# Altium schematic sheet 03_ANALOG.SchDoc: WMI (AFE)
size A4
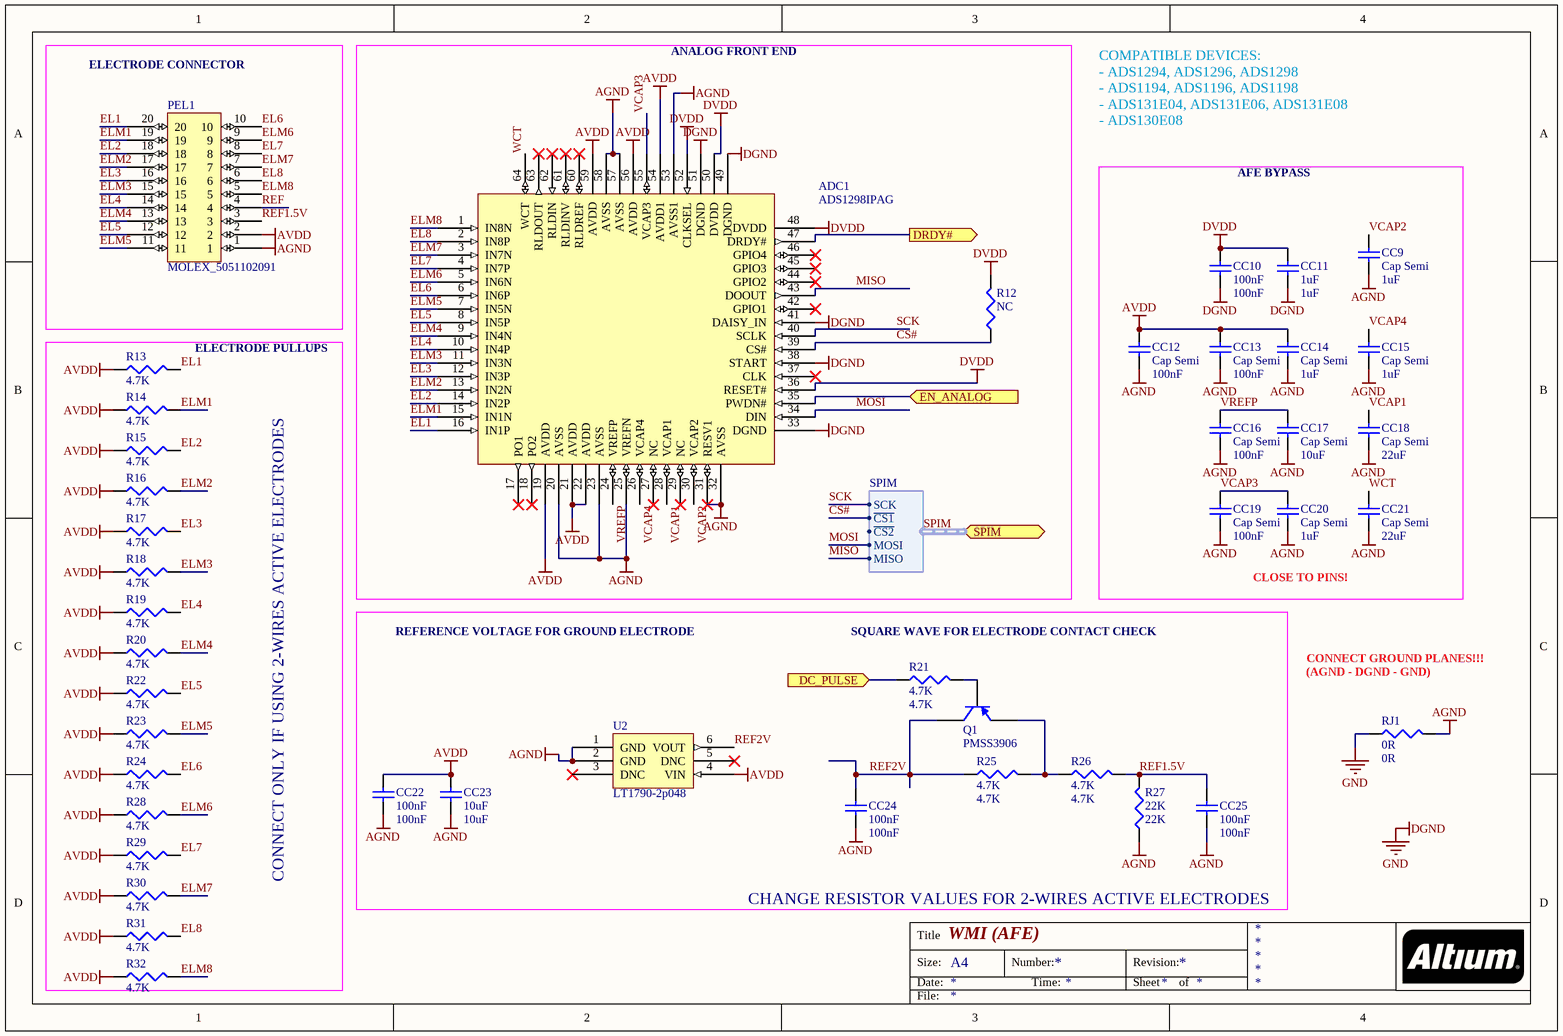
[diagram p0: 03_ANALOG.SchDoc]

## Parts
ADC1  ADS1298IPAG  [LQFP64_M]
CC9  Cap Semi  value 1uF  [0402]
CC10  100nF  [0402]
CC11  1uF  [0402]
CC12  Cap Semi  value 100nF  [0402]
CC13  Cap Semi  value 100nF  [0402]
CC14  Cap Semi  value 1uF  [0402]
CC15  Cap Semi  value 1uF  [0402]
CC16  Cap Semi  value 100nF  [0402]
CC17  Cap Semi  value 10uF  [0402]
CC18  Cap Semi  value 22uF  [J1-0603]
CC19  Cap Semi  value 100nF  [0402]
CC20  Cap Semi  value 1uF  [0402]
CC21  Cap Semi  value 22uF  [1608[0603]]
CC22  100nF  [0402]
CC23  10uF  [0402]
CC24  100nF  [0402]
CC25  100nF  [0402]
PEL1  MOLEX_5051102091  [MOLEX_5051102091]
Q1  PMSS3906  [SOT323_N]
R12  NC  [0402]
R13  4.7K  [0402]
R14  4.7K  [0402]
R15  4.7K  [0402]
R16  4.7K  [0402]
R17  4.7K  [0402]
R18  4.7K  [0402]
R19  4.7K  [0402]
R20  4.7K  [0402]
R21  4.7K  [0402]
R22  4.7K  [0402]
R23  4.7K  [0402]
R24  4.7K  [0402]
R25  4.7K  [0402]
R26  4.7K  [0402]
R27  22K  [0402]
R28  4.7K  [0402]
R29  4.7K  [0402]
R30  4.7K  [0402]
R31  4.7K  [0402]
R32  4.7K  [0402]
RJ1  0R  [0402]
U2  LT1790-2p048  [SOT-23_A_N]

## Blocks framed on the sheet
ELECTRODE CONNECTOR: PEL1
ANALOG FRONT END: ADC1 R12
CONNECT ONLY IF USING 2-WIRES ACTIVE ELECTRODES: R13-R20 R22-R24 R28-R32
CHANGE RESISTOR VALUES FOR 2-WIRES ACTIVE ELECTRODES: CC22-CC25 Q1 R21 R25-R27 U2

## Ports
DC_PULSE (in), DRDY# (out), EN_ANALOG (in), SPIM (harness SPIM)

## Harnesses
SPIM: SCK, ~{CS1}, ~{CS2}, MOSI, MISO

## Nets
AGND: ADC1.20(AVSS) ADC1.23(AVSS) ADC1.25(VREFN) ADC1.31(RESV1) ADC1.32(AVSS) ADC1.53(AVSS1) ADC1.57(AVSS) ADC1.58(AVSS) CC9.1 CC12.1 CC13.1 CC14.1 CC15.1 CC16.1 CC17.1 CC18.1 CC19.1 CC20.1 CC21.1 CC22.1 CC23.1 CC24.1 CC25.1 PEL1.1 R27.1 RJ1.2 U2.1(GND) U2.2(GND)
AVDD: ADC1.19(AVDD) ADC1.21(AVDD) ADC1.22(AVDD) ADC1.54(AVDD1) ADC1.56(AVDD) ADC1.59(AVDD) CC12.2 CC13.2 CC14.2 CC22.2 CC23.2 PEL1.2 R13.1 R14.1 R15.1 R16.1 R17.1 R18.1 R19.1 R20.1 R22.1 R23.1 R24.1 R28.1 R29.1 R30.1 R31.1 R32.1 U2.4(VIN)
DGND: ADC1.33(DGND) ADC1.38(START) ADC1.41(DAISY_IN) ADC1.49(DGND) ADC1.51(DGND) CC10.1 CC11.1 RJ1.1  [also labelled GND]
DVDD: ADC1.36(RESET#) ADC1.48(DVDD) ADC1.50(DVDD) ADC1.52(CLKSEL) CC10.2 CC11.2 R12.2
CS#: ADC1.39(CS#) R12.1 ; port SPIM.~{CS1}
DC_PULSE: R21.1 ; port DC_PULSE
DRDY#: ADC1.47(DRDY#) ; port DRDY#
EL1: ADC1.16(IN1P) PEL1.20 R13.2
EL2: ADC1.14(IN2P) PEL1.18 R15.2
EL3: ADC1.12(IN3P) PEL1.16 R17.2
EL4: ADC1.10(IN4P) PEL1.14 R19.2
EL5: ADC1.8(IN5P) PEL1.12 R22.2
EL6: ADC1.6(IN6P) PEL1.10 R24.2
EL7: ADC1.4(IN7P) PEL1.8 R29.2
EL8: ADC1.2(IN8P) PEL1.6 R31.2
ELM1: ADC1.15(IN1N) PEL1.19 R14.2
ELM2: ADC1.13(IN2N) PEL1.17 R16.2
ELM3: ADC1.11(IN3N) PEL1.15 R18.2
ELM4: ADC1.9(IN4N) PEL1.13 R20.2
ELM5: ADC1.7(IN5N) PEL1.11 R23.2
ELM6: ADC1.5(IN6N) PEL1.9 R28.2
ELM7: ADC1.3(IN7N) PEL1.7 R30.2
ELM8: ADC1.1(IN8N) PEL1.5 R32.2
EN_ANALOG: ADC1.35(PWDN#) ; port EN_ANALOG
MISO: ADC1.43(DOOUT) ; port SPIM.MISO
MOSI: ADC1.34(DIN) ; port SPIM.MOSI
REF: PEL1.4
REF1.5V: CC25.2 PEL1.3 R26.2 R27.2
REF2V: CC24.2 Q1.3(C) R25.1 U2.6(VOUT)
SCK: ADC1.40(SCLK) ; port SPIM.SCK
VCAP1: ADC1.28(VCAP1) CC18.2
VCAP2: ADC1.30(VCAP2) CC9.2
VCAP3: ADC1.55(VCAP3) CC19.2 CC20.2
VCAP4: ADC1.26(VCAP4) CC15.2
VREFP: ADC1.24(VREFP) CC16.2 CC17.2
WCT: ADC1.64(WCT) CC21.2
NetQ1_1: Q1.1(B) R21.2
NetQ1_2: Q1.2(E) R25.2 R26.1

Not connected (* = marked no-connect by the designer): ADC1 17(PO1)* 18(PO2)* 27(NC)* 29(NC)* 37(CLK)* 42(GPIO1)* 44(GPIO2)* 45(GPIO3)* 46(GPIO4)* 60(RLDREF)* 61(RLDINV)* 62(RLDIN)* 63(RLDOUT)*; U2 3(DNC)* 5(DNC)*

## Buses and harness runs
harness SPIM = port SPIM

## Notes on the sheet
- COMPATIBLE DEVICES:
  - ADS1294, ADS1296, ADS1298
  - ADS1194, ADS1196, ADS1198
  - ADS131E04, ADS131E06, ADS131E08
  - ADS130E08
- AFE BYPASS
- ELECTRODE PULLUPS
- CLOSE TO PINS!
- REFERENCE VOLTAGE FOR GROUND ELECTRODE
- (near R21) SQUARE WAVE FOR ELECTRODE CONTACT CHECK
- (AGND - DGND - GND)
- CONNECT GROUND PLANES!!!
- Title
- Size:
- Date:
- A4
- Number:
- Time:
- Revision:
- Sheet
- of
- File:

## Library data of the parts
ADC1 = ADS1298
CC9-CC25 = Cap Semi: Capacitor (Semiconductor SIM Model); Published: 8-Jun-2000; LatestRevisionDate: 29-May-2009; LatestRevisionNote: IPC-7351 Footprint Added.; PackageReference: C1206; Publisher: Altium Limited; PackageDescription: Chip Capacitor
  CC10 CC22 CC24 CC25: Value: 100nF
  CC11: Value: 1uF
  CC23: Value: 10uF
Q1 = PMSS3906: PNP Switching Transistor; Published: 17-Sep-2003; LatestRevisionDate: 12-Dec-2006; LatestRevisionNote: IPC-7351 Footprint Added.; DatasheetVersion: 22-Apr-1999; PackageVersion: Apr-1999; PackageReference: SOT323; Publisher: Altium Limited; PackageDescription: 3-Pin SOT-323 Package 0.65 mm Pitch, 2.1 mm Lead Span; ComponentLink1Description: Manufacturer Link; ComponentLink1URL: http://www.semiconductors.philips.com/; ComponentLink2Description: Datasheet; ComponentLink2URL: http://www.semiconductors.philips.com/acrobat/datasheets/PMSS3906_4.pdf
R12-R32 RJ1 = Res3: Resistor; Published: 8-Jun-2000; LatestRevisionDate: 29-May-2009; LatestRevisionNote: IPC-7351 Footprint Added.; PackageReference: J1-0603; Publisher: Altium Limited; PackageDescription: Chip Resistor
  R12: Value: NC
  R13-R26 R28-R32: Value: 4.7K
  R27: Value: 22K
  RJ1: Value: 0R
U2 = LT1790